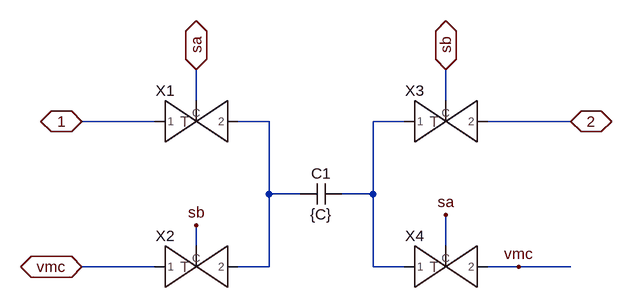
[diagram p0: schematic R4Ci_TGATE.asc]
R4Ci_TGATE.asc, the LTspice schematic file:
Version 4
SHEET 1 2116 680
WIRE 224 240 224 192
WIRE 608 240 608 192
WIRE 160 272 48 272
WIRE 336 272 288 272
WIRE 544 272 496 272
WIRE 800 272 672 272
WIRE 336 384 336 272
WIRE 384 384 336 384
WIRE 496 384 496 272
WIRE 496 384 448 384
WIRE 224 464 224 432
WIRE 608 464 608 416
WIRE 160 496 48 496
WIRE 336 496 336 384
WIRE 336 496 288 496
WIRE 496 496 496 384
WIRE 544 496 496 496
WIRE 720 496 672 496
WIRE 800 496 720 496
FLAG 224 192 sa
IOPIN 224 192 BiDir
FLAG 800 272 2
IOPIN 800 272 BiDir
FLAG 224 432 sb
FLAG 48 272 1
IOPIN 48 272 BiDir
FLAG 720 496 vmc
FLAG 608 192 sb
IOPIN 608 192 BiDir
FLAG 608 416 sa
FLAG 48 496 vmc
IOPIN 48 496 BiDir
SYMBOL cap 448 368 R90
WINDOW 0 0 32 VBottom 2
WINDOW 3 32 32 VTop 2
SYMATTR InstName C1
SYMATTR Value {C}
SYMBOL com_tgate 240 272 R0
SYMATTR InstName X1
SYMBOL com_tgate 240 496 R0
SYMATTR InstName X2
SYMBOL com_tgate 624 272 R0
SYMATTR InstName X3
SYMBOL com_tgate 624 496 R0
SYMATTR InstName X4

The netlist it stands for:
* R4Ci_TGATE.asc
C1 N002 N001 {C}
XX1 1 sa N001 com_tgate  ; pins 1 C 2
XX2 vmc sb N001 com_tgate  ; pins 1 C 2
XX3 N002 sb 2 com_tgate  ; pins 1 C 2
XX4 N002 sa vmc com_tgate  ; pins 1 C 2
.backanno
.end